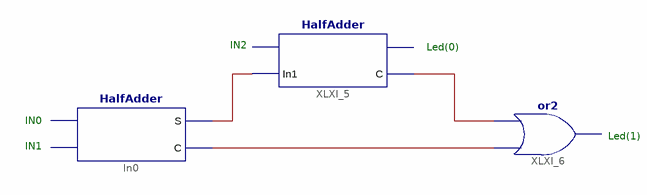
[diagram p0: schematic sheet 1]
// Xilinx ISE schematic FA_scheme.sch (spartan3e) as structural Verilog: 3 symbols, 0 ports
module FA_scheme (
);

  wire XLXN_12, XLXN_13, XLXN_14;

  HalfAdder In0 (.S(XLXN_14), .C(XLXN_12));  // open: In0, In1
  HalfAdder XLXI_5 (.In1(XLXN_14), .C(XLXN_13));  // open: In0, S
  // or2 XLXI_6 has open pins: I0=XLXN_12, I1=XLXN_13, O=open

  // Notes on the sheet:
  //   IN2
  //   Led(0)
  //   IN0
  //   Led(1)
  //   IN1
endmodule
